# Altium schematic sheet USB_nRF24L01_gateway.SchDoc
size A4
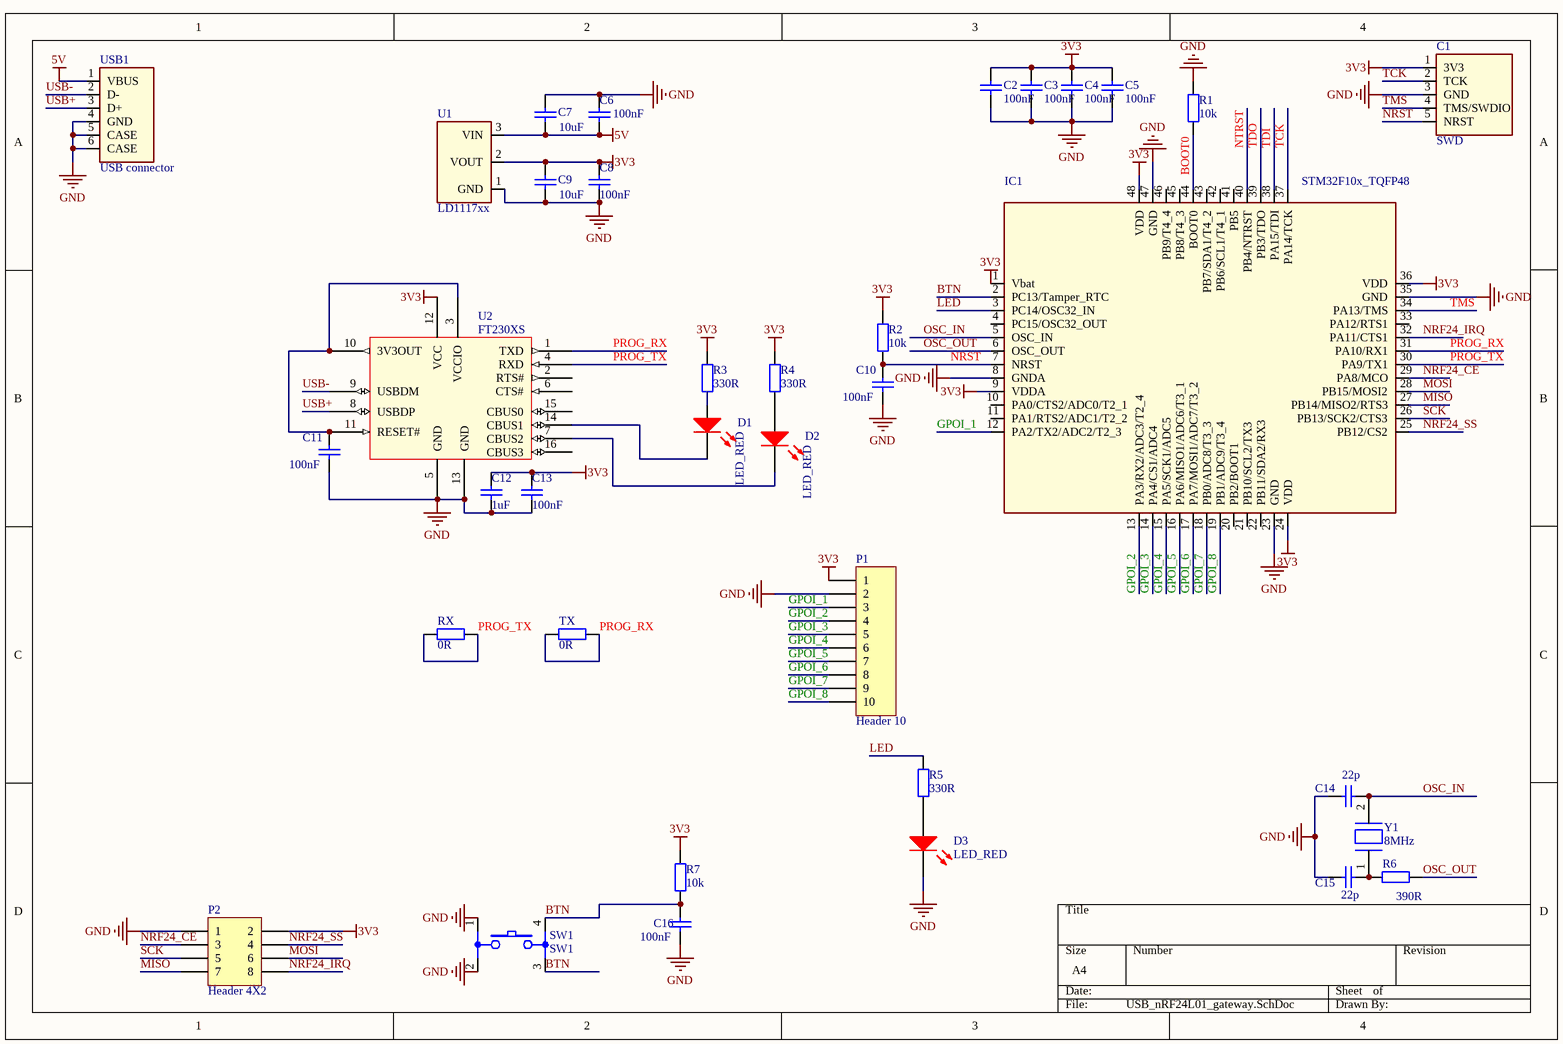
[diagram p0: USB_nRF24L01_gateway.SchDoc]

## Parts
C1  SWD  [SWD]
C2  100nF  [FP_0603_CAP_080]
C3  100nF  [FP_0603_CAP_080]
C4  100nF  [FP_0603_CAP_080]
C5  100nF  [FP_0603_CAP_080]
C6  100nF  [FP_0603_CAP_080]
C7  10uF  [FP_1206_CAP_085]
C8  100nF  [FP_0603_CAP_080]
C9  10uF  [FP_1206_CAP_085]
C10  100nF  [FP_0603_CAP_080]
C11  100nF  [FP_0603_CAP_080]
C12  1uF  [FP_0603_CAP_080]
C13  100nF  [FP_0603_CAP_080]
C14  22p  [FP_0603_CAP_080]
C15  22p  [FP_0603_CAP_080]
C16  100nF  [FP_0603_CAP_080]
D1  LED_RED  [FP_0805_LED_RED]
D2  LED_RED  [FP_0805_LED_RED]
D3  LED_RED  [FP_0805_LED_RED]
IC1  STM32F10x_TQFP48  [LQFP48_N]
P1  Header 10  [HDR1X10]
P2  Header 4X2  [FP_CONN8_SZK_ALLO]
R1  10k  [FP_0603_RES]
R2  10k  [FP_0603_RES]
R3  330R  [FP_0603_RES]
R4  330R  [FP_0603_RES]
R5  330R  [FP_0603_RES]
R6  390R  [FP_0603_RES]
R7  10k  [FP_0603_RES]
RX  0R  [FP_0603_RES]
SW1  SW1  [FP_TACTBTN]
TX  0R  [FP_0603_RES]
U1  LD1117xx  [SUPPLY_SOT223]
U2  FT230XS  [Digital_TSSOP16]
USB1  USB connector  [USB_A_th]
Y1  value 8MHz  [FP_CRYSTAL_HC49_TH]  (hidden comment: 8MHz Quartz HC49)

## Nets
3V3: C1.1(3V3) C2.2 C3.2 C4.2 C5.2 C8.1 C9.2 C12.1 C13.1 IC1.1(Vbat) IC1.9(VDDA) IC1.24(VDD) IC1.36(VDD) IC1.48(VDD) P1.1 P2.2 R2.1 R3.1 R4.1 R7.1 U1.2(VOUT) U2.12(VCC)
5V: C6.2 C7.1 U1.3(VIN) USB1.1(VBUS)
GND: C1.3(GND) C2.1 C3.1 C4.1 C5.1 C6.1 C7.2 C8.2 C9.1 C10.2 C11.2 C12.2 C13.2 C14.1 C15.1 C16.2 D3.K IC1.8(GNDA) IC1.23(GND) IC1.35(GND) IC1.47(GND) P1.2 P2.1 R1.1 SW1.1 SW1.2 U1.1(GND) U2.5(GND) U2.13(GND) USB1.4(GND) USB1.5(CASE) USB1.6(CASE)
BOOT0: IC1.44(BOOT0) R1.2
BTN: C16.1 IC1.2(PC13/Tamper_RTC) R7.2 SW1.3 SW1.4
GPOI_1: IC1.12(PA2/TX2/ADC2/T2_3) P1.3
GPOI_2: IC1.13(PA3/RX2/ADC3/T2_4) P1.4
GPOI_3: IC1.14(PA4/CS1/ADC4) P1.5
GPOI_4: IC1.15(PA5/SCK1/ADC5) P1.6
GPOI_5: IC1.16(PA6/MISO1/ADC6/T3_1) P1.7
GPOI_6: IC1.17(PA7/MOSI1/ADC7/T3_2) P1.8
GPOI_7: IC1.18(PB0/ADC8/T3_3) P1.9
GPOI_8: IC1.19(PB1/ADC9/T3_4) P1.10
LED: IC1.3(PC14/OSC32_IN) R5.1
MISO: IC1.27(PB14/MISO2/RTS3) P2.7
MOSI: IC1.28(PB15/MOSI2) P2.6
NRF24_CE: IC1.29(PA8/MCO) P2.3
NRF24_IRQ: IC1.32(PA11/CTS1) P2.8
NRF24_SS: IC1.25(PB12/CS2) P2.4
NRST: C1.5(NRST) C10.1 IC1.7(NRST) R2.2
NTRST: IC1.40(PB4/NTRST)
OSC_IN: C14.2 IC1.5(OSC_IN) Y1.2
OSC_OUT: IC1.6(OSC_OUT) R6.1
PROG_RX: IC1.31(PA10/RX1) TX.1 TX.2 U2.1(TXD)
PROG_TX: IC1.30(PA9/TX1) RX.1 RX.2 U2.4(RXD)
SCK: IC1.26(PB13/SCK2/CTS3) P2.5
TCK: C1.2(TCK) IC1.37(PA14/TCK)
TDI: IC1.38(PA15/TDI)
TDO: IC1.39(PB3/TDO)
TMS: C1.4(TMS/SWDIO) IC1.34(PA13/TMS)
USB+: U2.8(USBDP) USB1.3(D+)
USB-: U2.9(USBDM) USB1.2(D-)
NetC11_1: C11.1 U2.3(VCCIO) U2.10(3V3OUT) U2.11(RESET#)
NetC15_2: C15.2 R6.2 Y1.1
NetD1_A: D1.A R3.2
NetD1_K: D1.K U2.14(CBUS1)
NetD2_A: D2.A R4.2
NetD2_K: D2.K U2.7(CBUS2)
NetD3_A: D3.A R5.2

Not connected (* = marked no-connect by the designer): IC1 4(PC15/OSC32_OUT) 10(PA0/CTS2/ADC0/T2_1) 11(PA1/RTS2/ADC1/T2_2) 20(PB2/BOOT1) 21(PB10/SCL2/TX3) 22(PB11/SDA2/RX3) 33(PA12/RTS1) 41(PB5) 42(PB6/SCL1/T4_1) 43(PB7/SDA1/T4_2) 45(PB8/T4_3) 46(PB9/T4_4); U2 2(RTS#) 6(CTS#) 15(CBUS0) 16(CBUS3)

## Library data of the parts
C1 = SWD: ARM SWD connector
C2-C6 C8 C10 C11 C13-C16 = Cap: Capacitor; Order info: TODO; Tűrés: 10%
  C2-C5 C10 C11 C16: Value: 100nF
  C6 C8 C13: Published: 8-Jun-2000; LatestRevisionDate: 17-Jul-2002; LatestRevisionNote: Re-released for DXP Platform.; PackageReference: RAD-0.3; Publisher: Altium Limited; Value: 100nF
  C14 C15: Value: 22p
C7 C9 = Cap: Capacitor; Value: 100nF; Tűrés: 20% X7R; Order info: TODO; Published: 8-Jun-2000; LatestRevisionDate: 17-Jul-2002; LatestRevisionNote: Re-released for DXP Platform.; PackageReference: RAD-0.3; Publisher: Altium Limited; Order info: 82-07-81
C12 = Cap: Capacitor; Value: 100nF; Order info: TODO; Tűrés: 10%; Published: 8-Jun-2000; LatestRevisionDate: 17-Jul-2002; LatestRevisionNote: Re-released for DXP Platform.; PackageReference: RAD-0.3; Publisher: Altium Limited
D1-D3 = LED_R: Typical LED; Order info: TODO
P1 = Header 10: Header, 10-Pin; LatestRevisionDate: 17-Jul-2002; LatestRevisionNote: Re-released for DXP Platform.; Publisher: Altium Limited
P2 = Header 4X2: Header, 4-Pin, Dual row; LatestRevisionDate: 17-Jul-2002; LatestRevisionNote: Re-released for DXP Platform.; Publisher: Altium Limited
R1 R2 R6 R7 = Res3: Resistor; Order info: TODO; Tűrés: 5%
  R1 R2 R7: Value: 10k
  R6: Value: 390R
R3-R5 RX TX = Res3: Resistor; Value: 390; Order info: TODO; Tűrés: 5%; Published: 8-Jun-2000; LatestRevisionDate: 04-Mar-2005; LatestRevisionNote: PCB Footprint replaced.; PackageReference: J1-0603; Publisher: Altium Limited
U1 = LD1117xx: LD1117xx 3,3V lin reg; Order info: TODO; Order info: http://hu.mouser.com/ProductDetail/NXP/NX1117C33Z115/?qs=%2fha2pyFadui8%252bOpsKr9N%2fhvfdxjCMx%252bF0NTwqG%252bWOJY%3d
U2 = FT230XS: USB-SERIAL
USB1 = USB_B_TH: USB B conn TH
Y1 = XTAL HC49: Standard HC49 quartz; Order info: ugyanaz mint a feden
IC1 = STM32F10x_TQFP48: Order info: http://hu.farnell.com/stmicroelectronics/stm32f101cbt6/mcu-32bit-arm-cortex-m3-48lqfp/dp/1606324